# Altium schematic sheet LED.SchDoc: LED Cube 8x8x8 - LED
size A4; Author: Luka Penger; CompanyName: L. Penger; DrawnBy: Luka Penger; Organization: L. Penger; Address1: Luka Penger; Address2: http://lukapenger.eu; Address3: Software & Hardware; Address4: Development; DocumentNumber: 3; Revision: 4.0.0; SheetNumber: 3; SheetTotal: 5; DocumentName: LED; ProjectName: LED Cube 8x8x8
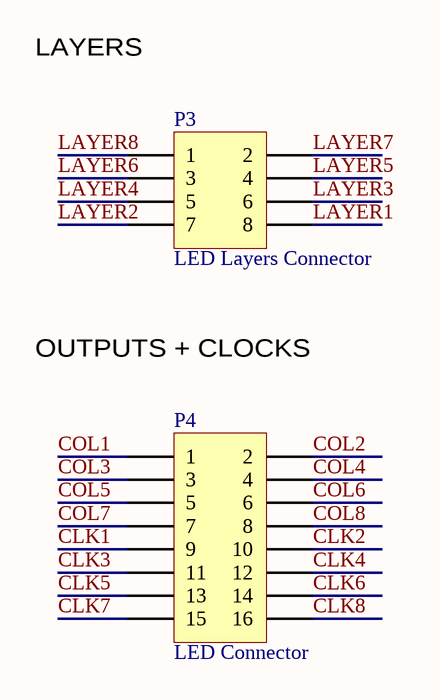
[diagram p0: LED.SchDoc]

## Parts
P3  LED Layers Connector  [IDC-2x4]
P4  LED Connector  [IDC-2x8]

## Nets
CLK1: P4.9
CLK2: P4.10
CLK3: P4.11
CLK4: P4.12
CLK5: P4.13
CLK6: P4.14
CLK7: P4.15
CLK8: P4.16
COL1: P4.1
COL2: P4.2
COL3: P4.3
COL4: P4.4
COL5: P4.5
COL6: P4.6
COL7: P4.7
COL8: P4.8
LAYER1: P3.8
LAYER2: P3.7
LAYER3: P3.6
LAYER4: P3.5
LAYER5: P3.4
LAYER6: P3.3
LAYER7: P3.2
LAYER8: P3.1

## Notes on the sheet
- LAYERS
- OUTPUTS + CLOCKS
- Title
- Size:
- Date:
- A4
- Number:
- Time:
- Revision:
- Sheet
- of
- File:

## Library data of the parts
P3 = Header 4X2: Header, 4-Pin, Dual row; LatestRevisionDate: 17-Jul-2002; LatestRevisionNote: Re-released for DXP Platform.; Publisher: Altium Limited
P4 = Header 8X2: Header, 8-Pin, Dual row; LatestRevisionDate: 17-Jul-2002; LatestRevisionNote: Re-released for DXP Platform.; Publisher: Altium Limited